# EAGLE design Raspi-MCP3008 (EAGLE 8.1.0)
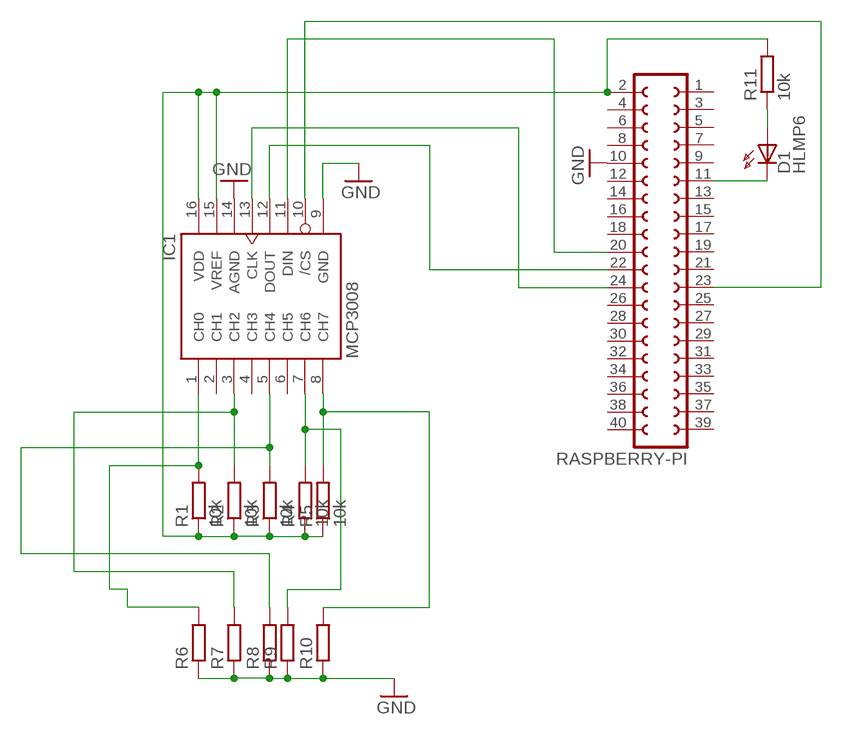
[diagram p0: schematic, sheet 1]

## Parts
D1  HLMP6  [HLMP6]
IC1  MCP3008  [DIL16]
R1  10k  R-EU_0207/10  [0207/10]
R2  10k  R-EU_0207/10  [0207/10]
R3  10k  R-EU_0207/10  [0207/10]
R4  10k  R-EU_0207/10  [0207/10]
R5  10k  R-EU_0207/10  [0207/10]
R6  R-EU_0204/2V  [0204V]
R7  R-EU_0204/2V  [0204V]
R8  R-EU_0204/2V  [0204V]
R9  R-EU_0204/2V  [0204V]
R10  R-EU_0204/2V  [0204V]
R11  10k  R-EU_0207/10  [0207/10]
RASPBERRY-PI  FE20-2  [FE20-2]

## Nets
GND: IC1.9(GND) IC1.14(AGND) R6.1 R7.1 R8.1 R9.1 R10.1 RASPBERRY-PI.10
N$1: D1.A R11.1
N$2: D1.K RASPBERRY-PI.11
N$3: IC1.13(CLK) RASPBERRY-PI.24
N$4: IC1.12(DOUT) RASPBERRY-PI.22
N$5: IC1.11(DIN) RASPBERRY-PI.20
N$6: IC1.10(/CS) RASPBERRY-PI.23
N$8: IC1.3(CH2) R2.2 R7.2
N$48: IC1.1(CH0) R1.2 R6.2
N$50: IC1.5(CH4) R3.2 R8.2
N$51: IC1.7(CH6) R4.2 R9.2
N$52: IC1.8(CH7) R5.2 R10.2
N$53: IC1.15(VREF) IC1.16(VDD) R1.1 R2.1 R3.1 R4.1 R5.1 R11.2 RASPBERRY-PI.2
Unconnected: IC1.2(CH1) IC1.4(CH3) IC1.6(CH5) RASPBERRY-PI.1 RASPBERRY-PI.3 RASPBERRY-PI.4 RASPBERRY-PI.5 RASPBERRY-PI.6 RASPBERRY-PI.7 RASPBERRY-PI.8 RASPBERRY-PI.9 RASPBERRY-PI.12 RASPBERRY-PI.13 RASPBERRY-PI.14 RASPBERRY-PI.15 RASPBERRY-PI.16 RASPBERRY-PI.17 RASPBERRY-PI.18 RASPBERRY-PI.19 RASPBERRY-PI.21 RASPBERRY-PI.25 RASPBERRY-PI.26 RASPBERRY-PI.27 RASPBERRY-PI.28 RASPBERRY-PI.29 RASPBERRY-PI.30 RASPBERRY-PI.31 RASPBERRY-PI.32 RASPBERRY-PI.33 RASPBERRY-PI.34 RASPBERRY-PI.35 RASPBERRY-PI.36 RASPBERRY-PI.37 RASPBERRY-PI.38 RASPBERRY-PI.39 RASPBERRY-PI.40

## Library data of the parts
D1 = display-hp:HLMP6: LED 2mm horizontal; MF: AGILENT TECHNOLOGIES; MPN: HLMP-6500; OC_FARNELL: 1652490; OC_NEWARK: 40K0088
IC1 = adafruit:MCP3008
R1-R11 = resistor:R-EU_: RESISTOR, European symbol
RASPBERRY-PI = con-lsta:FE20-2: FEMALE HEADER; OC_FARNELL: unknown; OC_NEWARK: unknown

## Module MCP3008
Ports: 

### Library data of the parts

## Board
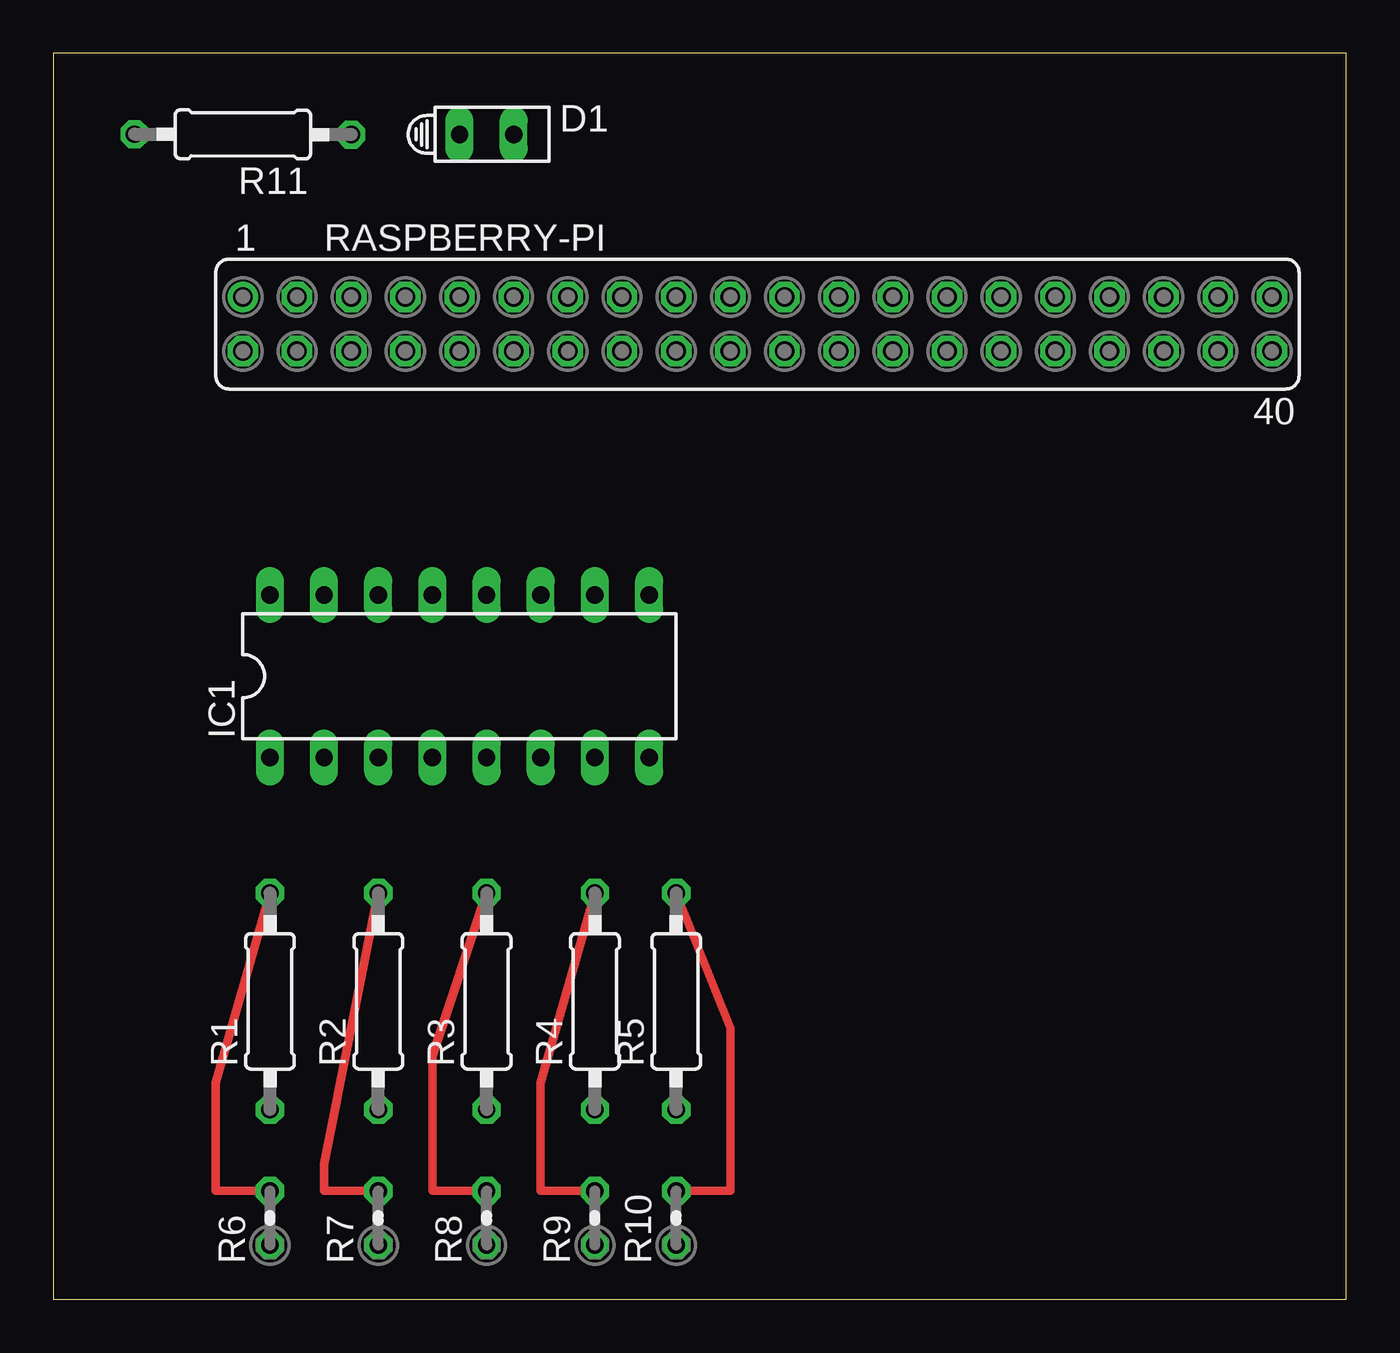
[diagram p1: board, top side]
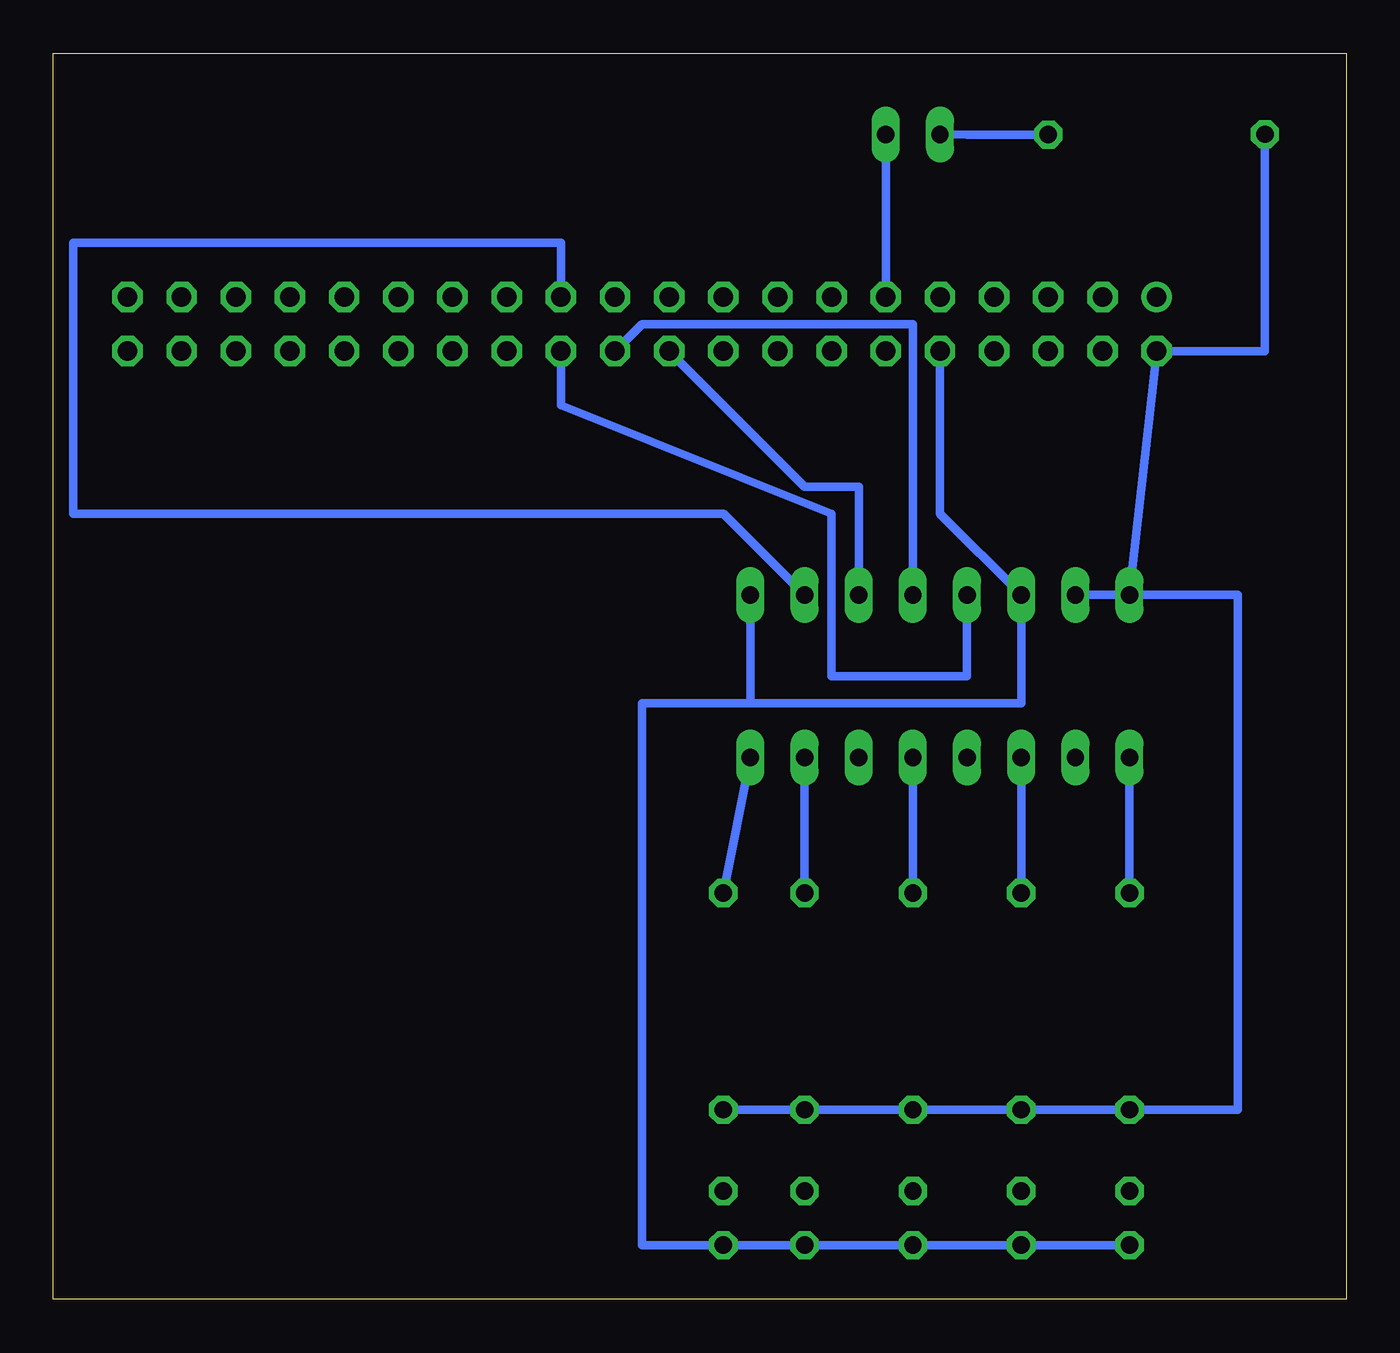
[diagram p2: board, bottom side, seen from below]

Size 60.63 x 58.41 mm. Coordinates in mm from the lower left corner, seen from the top.
Outline: 0,0 60.63,0 60.63,58.41 0,58.41 0,0
Copper layers (1*16): Top 0.035mm / dielectric 1.5mm / Bottom 0.035mm
Design rules "default": minimum track width 10mil, minimum drill 24mil, track to track 8mil, track to pad 8mil, pad to pad 8mil, via to via 8mil, smd to smd 8mil, copper to edge 40mil, drill to drill 8mil, minimum pad ring 10mil, minimum via ring 8mil, stop-mask expansion 4mil, vias tented up to drill 0mil, thermal gap 10mil

### Footprints (pad centres in the part's own frame; a part is rotated, then mirrored left to right if it is on the bottom)
HLMP6 = drill 0.813 long: A -1.27,0; K 1.27,0
DIL16 = drill 0.813 long: 1 -8.89,-3.81; 2 -6.35,-3.81; 3 -3.81,-3.81; 4 -1.27,-3.81; 5 1.27,-3.81; 6 3.81,-3.81; 7 6.35,-3.81; 8 8.89,-3.81; 9 8.89,3.81; 10 6.35,3.81; 11 3.81,3.81; 12 1.27,3.81; 13 -1.27,3.81; 14 -3.81,3.81; 15 -6.35,3.81; 16 -8.89,3.81
0207/10 = drill 0.813 octagon: 1 -5.08,0; 2 5.08,0
0204V = drill 0.813 octagon: 1 -1.27,0; 2 1.27,0
FE20-2 = drill 0.914: 1 -24.13,1.27 | drill 0.914 octagon: 2 -24.13,-1.27; 3 -21.59,1.27; 4 -21.59,-1.27; 5 -19.05,1.27; 6 -19.05,-1.27; 7 -16.51,1.27; 8 -16.51,-1.27; 9 -13.97,1.27; 10 -13.97,-1.27; 11 -11.43,1.27; 12 -11.43,-1.27; 13 -8.89,1.27; 14 -8.89,-1.27; 15 -6.35,1.27; 16 -6.35,-1.27; 17 -3.81,1.27; 18 -3.81,-1.27; 19 -1.27,1.27; 20 -1.27,-1.27; 21 1.27,1.27; 22 1.27,-1.27; 23 3.81,1.27; 24 3.81,-1.27; 25 6.35,1.27; 26 6.35,-1.27; 27 8.89,1.27; 28 8.89,-1.27; 29 11.43,1.27; 30 11.43,-1.27; 31 13.97,1.27; 32 13.97,-1.27; 33 16.51,1.27; 34 16.51,-1.27; 35 19.05,1.27; 36 19.05,-1.27; 37 21.59,1.27; 38 21.59,-1.27; 39 24.13,1.27; 40 24.13,-1.27

### Placement (x,y rotation side)
D1  20.32,54.61 0 top
IC1  19.05,29.21 0 top
R1  10.16,13.97 90 top
R2  15.24,13.97 90 top
R3  20.32,13.97 90 top
R4  25.4,13.97 90 top
R5  29.21,13.97 90 top
R6  10.16,3.81 90 top
R7  15.24,3.81 90 top
R8  20.32,3.81 90 top
R9  25.4,3.81 90 top
R10  29.21,3.81 90 top
R11  8.89,54.61 179.9 top
RASPBERRY-PI  33.02,45.72 0 top

### Tracks (layer width: path | path; a pad name or v marks a point on that pad's centre or on a via)
GND
  Bottom 0.406: 27.94,27.94 15.24,27.94 IC1.14 19.05,36.83 RASPBERRY-PI.10 | 27.94,27.94 IC1.9 | R6.1 R7.1 R8.1 R9.1 R10.1 33.02,2.54 33.02,27.94 27.94,27.94
N$1
  Bottom 0.406: R11.1 17.78,54.6 D1.A
N$2
  Bottom 0.406: D1.K RASPBERRY-PI.11
N$3
  Top 0.254: 17.86,33.07 IC1.13 | 36.83,44.65 RASPBERRY-PI.24
  Bottom 0.406: IC1.13 17.78,29.21 24.13,29.21 24.13,36.83 36.83,41.91 RASPBERRY-PI.24
N$4
  Bottom 0.406: IC1.12 20.32,45.72 33.02,45.72 RASPBERRY-PI.22
N$5
  Top 0.254: 22.88,33.07 IC1.11 | 31.57,44.42 RASPBERRY-PI.20
  Bottom 0.406: IC1.11 22.86,38.1 25.4,38.1 RASPBERRY-PI.20
N$6
  Bottom 0.406: IC1.10 29.21,36.83 59.69,36.83 59.69,49.53 36.83,49.53 RASPBERRY-PI.23
N$8
  Top 0.406: R7.2 12.7,5.08 12.7,6.35 R2.2
  Bottom 0.406: IC1.3 R2.2
N$48
  Top 0.406: R6.2 7.62,5.08 7.62,10.16 R1.2
  Bottom 0.406: IC1.1 R1.2
N$50
  Top 0.254: 20.14,25.3 IC1.5
  Top 0.406: R8.2 17.78,5.08 17.78,11.43 R3.2
  Bottom 0.406: R3.2 IC1.5
N$51
  Top 0.406: R9.2 22.86,5.08 22.86,10.16 R4.2
  Bottom 0.406: IC1.7 R4.2
N$52
  Top 0.406: R10.2 31.75,5.08 31.75,12.7 R5.2
  Bottom 0.406: IC1.8 R5.2
N$53
  Bottom 0.406: R5.1 R4.1 R3.1 R2.1 R1.1 5.08,8.89 5.08,33.02 IC1.16 | IC1.16 IC1.15 | IC1.16 RASPBERRY-PI.2 3.81,44.45 3.81,52.08 R11.2